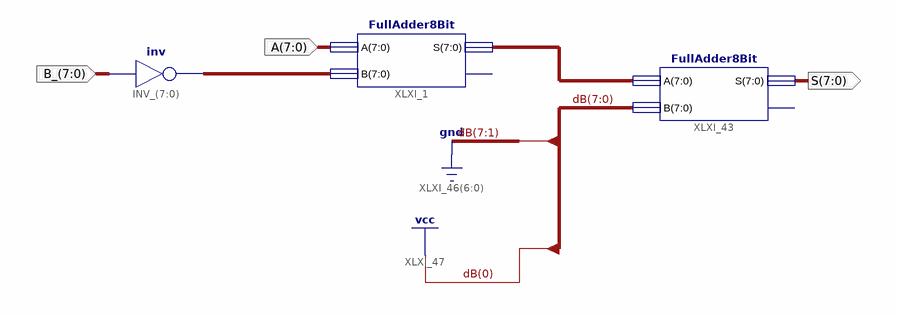
[diagram p0: schematic sheet 1]
// Xilinx ISE schematic FullSub8Bit.sch (spartan6) as structural Verilog: 3 symbols, 3 ports
module FullSub8Bit (
  input  [7:0] B_,
  input  [7:0] A,
  output [7:0] S
);

  wire [7:0] XLXN_28, XLXN_43;

  FullAdder8Bit XLXI_1 (.A(A), .B(XLXN_28), .S(XLXN_43));  // open: CO
  FullAdder8Bit XLXI_43 (.A(XLXN_43), .B(8'b00000001), .S(S));  // open: CO
  assign XLXN_28 = ~B_;  // inv INV_[7..0], 8 bits wide
endmodule
